# Altium schematic sheet MCU.SchDoc
size A3
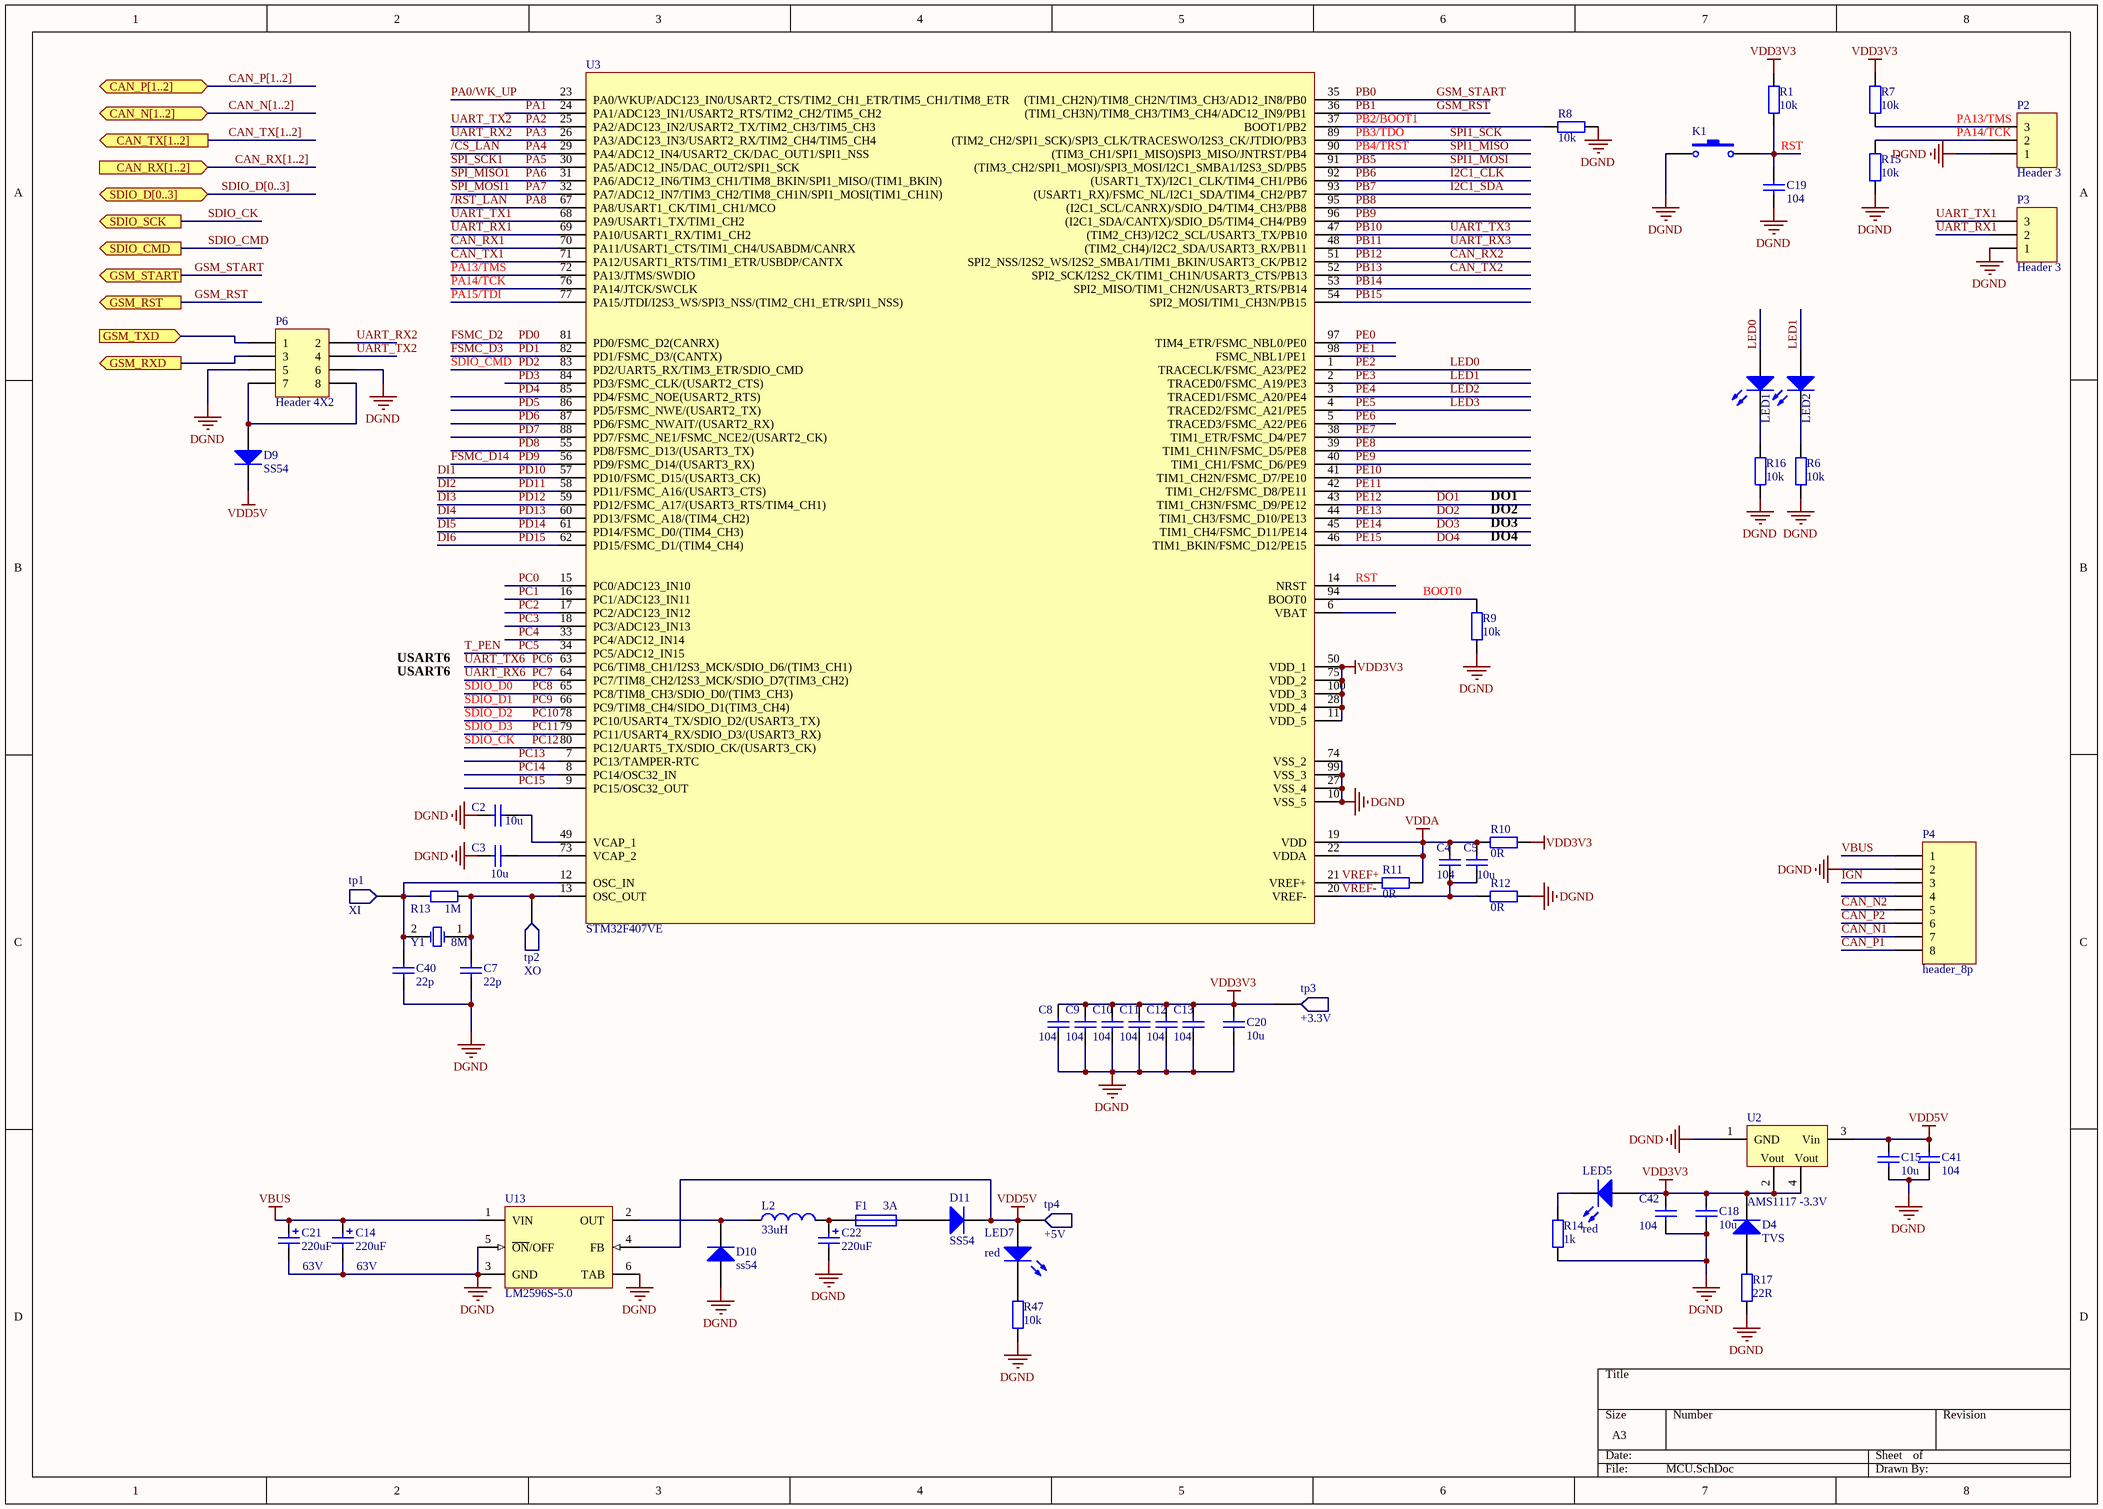
[diagram p0: MCU.SchDoc]

## Parts
C2  10u  [0603_]
C3  10u  [0603_]
C4  104  [0603_]
C5  10u  [0603_]
C7  22p  [0603_]
C8  104  [0603_]
C9  104  [0603_]
C10  104  [0603_]
C11  104  [0603_]
C12  104  [0603_]
C13  104  [0603_]
C14  220uF  VDC_: 63V  [Cap - 10mmx10mm]
C15  10u  [0603_]
C18  10u  [0603_]
C19  104  [0603_]
C20  10u  [0603_]
C21  220uF  VDC_: 63V  [Cap - 10mmx10mm]
C22  220uF  [Cap - 10mmx10mm]
C40  22p  [0603_]
C41  104  [0603_]
C42  104  [0603_]
D4  TVS  [SMB]
D9  SS54  [SMA]
D10  ss54  [SMA]
D11  SS54  [SMA]
F1  3A  [3216]
K1  k  [key-2pin]  (value not drawn)
L2  33uH  [Induct 7*7*4]
LED1  red  [0603_diode]  (value not drawn)
LED2  red  [0603_diode]  (value not drawn)
LED5  red  [0603_diode]
LED7  red  [0603_diode]
P2  Header 3  [HDR1X3]
P3  Header 3  [HDR1X3]
P4  header_8p  [WJ2EDG5.08-8P]
P6  Header 4X2  [HDR2X4]
R1  10k  [0603_]
R6  10k  [0603_]
R7  10k  [0603_]
R8  10k  [0603_]
R9  10k  [0603_]
R10  0R  [0603_]
R11  0R  [0603_]
R12  0R  [0603_]
R13  1M  [0603_]
R14  1k  [0603_]
R15  10k  [0603_]
R16  10k  [0603_]
R17  22R  [0603_]
R47  10k  [0603_]
tp1  XI  [testPoint_s]
tp2  XO  [testPoint_s]
tp3  +3.3V  [testPoint]
tp4  +5V  [testPoint]
U2  AMS1117 -3.3V  [SOT-223]
U3  STM32F407VE  [LQFP100-M]
U13  LM2596S-5.0  [TS5B_N]
Y1  8M  [xtal]

## Ports
CAN_N[1..2] (bidir), CAN_P[1..2] (bidir), CAN_RX[1..2] (in), CAN_TX[1..2] (out), GSM_RST (out), GSM_RXD (out), GSM_START (out), GSM_TXD (in), SDIO_CMD (out), SDIO_D[0..3] (bidir), SDIO_SCK (out)

## Nets
DGND: C2.1 C3.1 C7.1 C8.2 C9.2 C10.2 C11.2 C12.2 C13.2 C14.2 C15.1 C18.1 C19.2 C20.1 C21.2 C22.2 C40.1 C41.2 C42.2 D10.A K1.1 P2.1 P3.1 P4.2 P6.5 P6.6 R6.2 R8.2 R9.2 R12.2 R14.1 R15.2 R16.2 R17.1 R47.2 U2.1(GND) U3.10(VSS_5) U3.27(VSS_4) U3.74(VSS_2) U3.99(VSS_3) U13.3(GND) U13.5(~{ON}/OFF) U13.6(TAB)
VBUS: C14.1 C21.1 P4.1 U13.1(VIN)
VDD3V3: C8.1 C9.1 C10.1 C11.1 C12.1 C13.1 C18.2 C20.2 C42.1 D4.K LED5.1(A) R1.1 R7.1 R10.2 tp3.1 U2.2(Vout) U2.4(Vout) U3.11(VDD_5) U3.28(VDD_4) U3.50(VDD_1) U3.75(VDD_2) U3.100(VDD_3)
VDD5V: C15.2 C41.1 D9.K D11.K LED7.1(A) tp4.1 U2.3(Vin) U13.4(FB)
VDDA: C4.1 C5.1 R10.1 R11.2 U3.19(VDD) U3.22(VDDA)
/CS_LAN: U3.29(PA4/ADC12_IN4/USART2_CK/DAC_OUT1/SPI1_NSS)  [also labelled PA4]
/RST_LAN: U3.67(PA8/USART1_CK/TIM1_CH1/MCO)  [also labelled PA8]
BOOT0: R9.1 U3.94(BOOT0)
CAN_N1: P4.7
CAN_N2: P4.5
CAN_P1: P4.8
CAN_P2: P4.6
CAN_RX1: U3.70(PA11/USART1_CTS/TIM1_CH4/USABDM/CANRX)
CAN_RX2: U3.51(SPI2_NSS/I2S2_WS/I2S2_SMBA1/TIM1_BKIN/USART3_CK/PB12)  [also labelled PB12]
CAN_TX1: U3.71(PA12/USART1_RTS/TIM1_ETR/USBDP/CANTX)
CAN_TX2: U3.52(SPI2_SCK/I2S2_CK/TIM1_CH1N/USART3_CTS/PB13)  [also labelled PB13]
DI1: U3.57(PD10/FSMC_D15/(USART3_CK))  [also labelled PD10]
DI2: U3.58(PD11/FSMC_A16/(USART3_CTS))  [also labelled PD11]
DI3: U3.59(PD12/FSMC_A17/(USART3_RTS/TIM4_CH1))  [also labelled PD12]
DI4: U3.60(PD13/FSMC_A18/(TIM4_CH2))  [also labelled PD13]
DI5: U3.61(PD14/FSMC_D0/(TIM4_CH3))  [also labelled PD14]
DI6: U3.62(PD15/FSMC_D1/(TIM4_CH4))  [also labelled PD15]
DO1: U3.43(TIM1_CH3N/FSMC_D9/PE12)  [also labelled PE12]
DO2: U3.44(TIM1_CH3/FSMC_D10/PE13)  [also labelled PE13]
DO3: U3.45(TIM1_CH4/FSMC_D11/PE14)  [also labelled PE14]
DO4: U3.46(TIM1_BKIN/FSMC_D12/PE15)  [also labelled PE15]
FSMC_D2: U3.81(PD0/FSMC_D2(CANRX))  [also labelled PD0]
FSMC_D3: U3.82(PD1/FSMC_D3/(CANTX))  [also labelled PD1]
FSMC_D14: U3.56(PD9/FSMC_D14/(USART3_RX))  [also labelled PD9]
GSM_RST: U3.36((TIM1_CH3N)/TIM8_CH3/TIM3_CH4/ADC12_IN9/PB1) ; port GSM_RST  [also labelled PB1]
GSM_RXD: P6.3 ; port GSM_RXD
GSM_START: U3.35((TIM1_CH2N)/TIM8_CH2N/TIM3_CH3/AD12_IN8/PB0) ; port GSM_START  [also labelled PB0]
GSM_TXD: P6.1 ; port GSM_TXD
I2C1_CLK: U3.92((USART1_TX)/I2C1_CLK/TIM4_CH1/PB6)  [also labelled PB6]
I2C1_SDA: U3.93((USART1_RX)/FSMC_NL/I2C1_SDA/TIM4_CH2/PB7)  [also labelled PB7]
IGN: P4.3
LED0: LED1.1(A) U3.1(TRACECLK/FSMC_A23/PE2)  [also labelled PE2]
LED1: LED2.1(A) U3.2(TRACED0/FSMC_A19/PE3)  [also labelled PE3]
LED2: U3.3(TRACED1/FSMC_A20/PE4)  [also labelled PE4]
LED3: U3.4(TRACED2/FSMC_A21/PE5)  [also labelled PE5]
PA0/WK_UP: U3.23(PA0/WKUP/ADC123_IN0/USART2_CTS/TIM2_CH1_ETR/TIM5_CH1/TIM8_ETR)
PA1: U3.24(PA1/ADC123_IN1/USART2_RTS/TIM2_CH2/TIM5_CH2)
PA2: P6.4 U3.25(PA2/ADC123_IN2/USART2_TX/TIM2_CH3/TIM5_CH3)  [also labelled UART_TX2]
PA3: P6.2 U3.26(PA3/ADC123_IN3/USART2_RX/TIM2_CH4/TIM5_CH4)  [also labelled UART_RX2]
PA5: U3.30(PA5/ADC12_IN5/DAC_OUT2/SPI1_SCK)  [also labelled SPI_SCK1]
PA6: U3.31(PA6/ADC12_IN6/TIM3_CH1/TIM8_BKIN/SPI1_MISO/(TIM1_BKIN))  [also labelled SPI_MISO1]
PA7: U3.32(PA7/ADC12_IN7/TIM3_CH2/TIM8_CH1N/SPI1_MOSI(TIM1_CH1N))  [also labelled SPI_MOSI1]
PA13/TMS: P2.3 R7.2 U3.72(PA13/JTMS/SWDIO)
PA14/TCK: P2.2 R15.1 U3.76(PA14/JTCK/SWCLK)
PA15/TDI: U3.77(PA15/JTDI/I2S3_WS/SPI3_NSS/(TIM2_CH1_ETR/SPI1_NSS))
PB2/BOOT1: R8.1 U3.37(BOOT1/PB2)
PB3/TDO: U3.89((TIM2_CH2/SPI1_SCK)/SPI3_CLK/TRACESWO/I2S3_CK/JTDIO/PB3)  [also labelled SPI1_SCK]
PB4/TRST: U3.90((TIM3_CH1/SPI1_MISO)SPI3_MISO/JNTRST/PB4)  [also labelled SPI1_MISO]
PB5: U3.91((TIM3_CH2/SPI1_MOSI)/SPI3_MOSI/I2C1_SMBA1/I2S3_SD/PB5)  [also labelled SPI1_MOSI]
PB8: U3.95((I2C1_SCL/CANRX)/SDIO_D4/TIM4_CH3/PB8)
PB9: U3.96((I2C1_SDA/CANTX)/SDIO_D5/TIM4_CH4/PB9)
PB10: U3.47((TIM2_CH3)/I2C2_SCL/USART3_TX/PB10)  [also labelled UART_TX3]
PB11: U3.48((TIM2_CH4)/I2C2_SDA/USART3_RX/PB11)  [also labelled UART_RX3]
PB14: U3.53(SPI2_MISO/TIM1_CH2N/USART3_RTS/PB14)
PB15: U3.54(SPI2_MOSI/TIM1_CH3N/PB15)
PC0: U3.15(PC0/ADC123_IN10)
PC1: U3.16(PC1/ADC123_IN11)
PC2: U3.17(PC2/ADC123_IN12)
PC3: U3.18(PC3/ADC123_IN13)
PC4: U3.33(PC4/ADC12_IN14)
PC5: U3.34(PC5/ADC12_IN15)  [also labelled T_PEN]
PC6: U3.63(PC6/TIM8_CH1/I2S3_MCK/SDIO_D6/(TIM3_CH1))  [also labelled UART_TX6]
PC7: U3.64(PC7/TIM8_CH2/I2S3_MCK/SDIO_D7(TIM3_CH2))  [also labelled UART_RX6]
PC8: U3.65(PC8/TIM8_CH3/SDIO_D0/(TIM3_CH3))  [also labelled SDIO_D0]
PC9: U3.66(PC9/TIM8_CH4/SIDO_D1(TIM3_CH4))  [also labelled SDIO_D1]
PC10: U3.78(PC10/USART4_TX/SDIO_D2/(USART3_TX))  [also labelled SDIO_D2]
PC11: U3.79(PC11/USART4_RX/SDIO_D3/(USART3_RX))  [also labelled SDIO_D3]
PC12: U3.80(PC12/UART5_TX/SDIO_CK/(USART3_CK)) ; port SDIO_SCK  [also labelled SDIO_CK]
PC13: U3.7(PC13/TAMPER-RTC)
PC14: U3.8(PC14/OSC32_IN)
PC15: U3.9(PC15/OSC32_OUT)
PD2: U3.83(PD2/UART5_RX/TIM3_ETR/SDIO_CMD) ; port SDIO_CMD  [also labelled SDIO_CMD]
PD3: U3.84(PD3/FSMC_CLK/(USART2_CTS))
PD4: U3.85(PD4/FSMC_NOE(USART2_RTS))
PD5: U3.86(PD5/FSMC_NWE/(USART2_TX))
PD6: U3.87(PD6/FSMC_NWAIT/(USART2_RX))
PD7: U3.88(PD7/FSMC_NE1/FSMC_NCE2/(USART2_CK))
PD8: U3.55(PD8/FSMC_D13/(USART3_TX))
PE0: U3.97(TIM4_ETR/FSMC_NBL0/PE0)
PE1: U3.98(FSMC_NBL1/PE1)
PE6: U3.5(TRACED3/FSMC_A22/PE6)
PE7: U3.38(TIM1_ETR/FSMC_D4/PE7)
PE8: U3.39(TIM1_CH1N/FSMC_D5/PE8)
PE9: U3.40(TIM1_CH1/FSMC_D6/PE9)
PE10: U3.41(TIM1_CH2N/FSMC_D7/PE10)
PE11: U3.42(TIM1_CH2/FSMC_D8/PE11)
RST: C19.1 K1.2 R1.2 U3.14(NRST)
UART_RX1: P3.2 U3.69(PA10/USART1_RX/TIM1_CH2)
UART_TX1: P3.3 U3.68(PA9/USART1_TX/TIM1_CH2)
VREF+: R11.1 U3.21(VREF+)
VREF-: C4.2 C5.2 R12.1 U3.20(VREF-)
NetC2_2: C2.2 U3.49(VCAP_1)
NetC3_2: C3.2 U3.73(VCAP_2)
NetC7_2: C7.2 R13.1 tp2.1 U3.13(OSC_OUT) Y1.1(OSC1)
NetC22_1: C22.1 F1.1 L2.2
NetC40_2: C40.2 R13.2 tp1.1 U3.12(OSC_IN) Y1.2(OSC2)
NetD4_A: D4.A R17.2
NetD9_A: D9.A P6.7 P6.8
NetD10_K: D10.K L2.1 U13.2(OUT)
NetD11_A: D11.A F1.2
NetLED1_2: LED1.2(K) R16.1
NetLED2_2: LED2.2(K) R6.1
NetLED5_2: LED5.2(K) R14.2
NetLED7_2: LED7.2(K) R47.1

Not connected (* = marked no-connect by the designer): P4 4; U3 6(VBAT)

## Buses and harness runs
bus CAN_N[1..2] = port CAN_N[1..2]
bus CAN_P[1..2] = port CAN_P[1..2]
bus CAN_RX[1..2] = port CAN_RX[1..2]
bus CAN_TX[1..2] = port CAN_TX[1..2]
bus SDIO_D[0..3] = port SDIO_D[0..3]

## Notes on the sheet
- DO1
- DO2
- DO3
- DO4
- USART6

## Library data of the parts
C2-C5 C7-C13 C15 C18-C20 C40-C42 = cap: VDC_V: 16V; Tolerance_: ±10%
C14 C21 = cap-pol: Tolerance_: ±10%
C22 = cap-pol: VDC_: 16V; Tolerance_: ±10%
D4 D9-D11 = diode
F1 = FUSE
K1 = SW
L2 = inductor: Current_: ?A
LED1 LED2 LED5 LED7 = led
P2 P3 = Header 3: Header, 3-Pin; LatestRevisionDate: 17-Jul-2002; LatestRevisionNote: Re-released for DXP Platform.; Publisher: Altium Limited
P4 = header_8p: Pheonix Connector
P6 = Header 4X2: Header, 4-Pin, Dual row; LatestRevisionDate: 17-Jul-2002; LatestRevisionNote: Re-released for DXP Platform.; Publisher: Altium Limited
R1 R6 R7 R9-R16 = res: Tolerance_: ±5%; Power_W: 1/16W
R8 = res: Tolerance_: ±5%
R17 R47 = res: Tolerance_: ±5%; Power_: ?W
tp1-tp4 = pad
U2 = AMS1117
U13 = LM2596S-3.3: SIMPLE SWITCHER Power Converter 150 KHz 3A Step-Down Voltage Regulator; Manufacturer: National Semiconductor; PackageTopMarking: NSUZXYTT*LM2596S*-3.3 P+; Published: 27-Nov-2008; DatasheetVersion: May-2002; PackageVersion: revD, Apr-2005; PackageReference: TS5B; Publisher: Altium Limited; PackageDescription: TO-263, Molded, .400 x .390 x .180in, 5 Lead, .067in Pitch, Surface Mount; CompType: Switcher; PartNumber: LM2596S-3.3; RoHS: O; PinCount: 5; DigiKeyPartNumber: LM2596S-3.3-ND; Code_JEDEC: MO-169-AB; ComponentLink1Description: LM2596 Datasheet; ComponentLink1URL: http://www.national.com/ds/LM/LM2596.pdf; ComponentLink2Description: LM2596 Web Page; ComponentLink2URL: http://www.national.com/pf/LM/LM2596.html; ComponentLink3Description: TS5B Package Page; ComponentLink3URL: http://www.national.com/packaging/folders/ts5b.html
Y1 = xtal